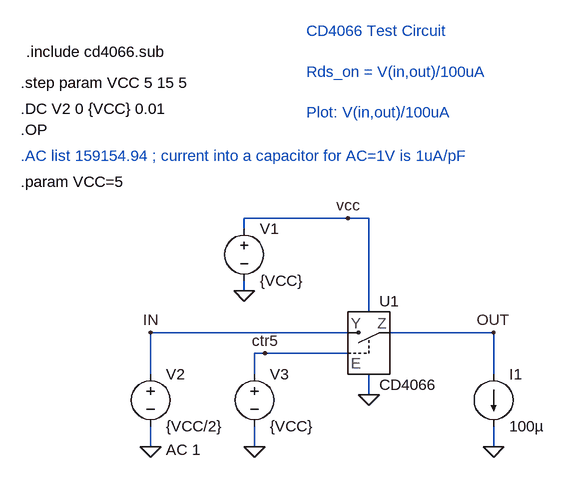
[diagram p0: schematic CD4066_test.asc]
CD4066_test.asc, the LTspice schematic file:
Version 4
SHEET 1 2080 1316
WIRE 208 0 48 0
WIRE 240 0 208 0
WIRE 48 16 48 0
WIRE 48 112 48 96
WIRE 240 144 240 0
WIRE 208 176 -96 176
WIRE 432 176 272 176
WIRE 80 208 64 208
WIRE 208 208 80 208
WIRE -96 240 -96 176
WIRE 64 240 64 208
WIRE 432 240 432 176
WIRE 240 272 240 240
WIRE -96 352 -96 320
WIRE 64 352 64 320
WIRE 432 352 432 320
FLAG 48 112 0
FLAG -96 352 0
FLAG 64 352 0
FLAG 240 272 0
FLAG -96 176 IN
FLAG 432 176 OUT
FLAG 208 0 vcc
FLAG 80 208 ctr5
FLAG 432 352 0
SYMBOL voltage 48 0 R0
SYMATTR InstName V1
SYMATTR Value {VCC}
SYMBOL voltage -96 224 R0
WINDOW 123 24 132 Left 0
WINDOW 39 0 0 Left 0
SYMATTR Value2 AC 1
SYMATTR InstName V2
SYMATTR Value {VCC/2}
SYMBOL voltage 64 224 R0
SYMATTR InstName V3
SYMATTR Value {VCC}
SYMBOL CD4066 240 192 R0
SYMATTR InstName U1
SYMBOL current 432 240 R0
SYMATTR InstName I1
SYMATTR Value 100µ
TEXT -296 -136 Left 0 !.OP
TEXT -296 -168 Left 0 !.DC V2 0 {VCC} 0.01
TEXT -288 -256 Left 0 !.include cd4066.sub
TEXT -296 -208 Left 0 !.step param VCC 5 15 5
TEXT -296 -96 Left 0 ;.AC list 159154.94 ; current into a capacitor for AC=1V is 1uA/pF
TEXT 144 -288 Left 0 ;CD4066 Test Circuit\n \nRds_on = V(in,out)/100uA\n \nPlot: V(in,out)/100uA
TEXT -296 -56 Left 0 !.param VCC=5

The netlist it stands for:
* CD4066_test.asc
V1 vcc 0 {VCC}
V2 IN 0 {VCC/2} AC 1
V3 ctr5 0 {VCC}
XU1 ctr5 IN OUT vcc 0 CD4066  ; pins EN Y OUT VCC VSS
I1 OUT 0 100µ
.OP
.DC V2 0 {VCC} 0.01
.include cd4066.sub
.step param VCC 5 15 5
* .AC list 159154.94 ; current into a capacitor for AC=1V is 1uA/pF
* CD4066 Test Circuit
* Rds_on = V(in,out)/100uA
* Plot: V(in,out)/100uA
.param VCC=5
.backanno
.end